# EAGLE design Parameter-Board-8 (EAGLE 6.0)
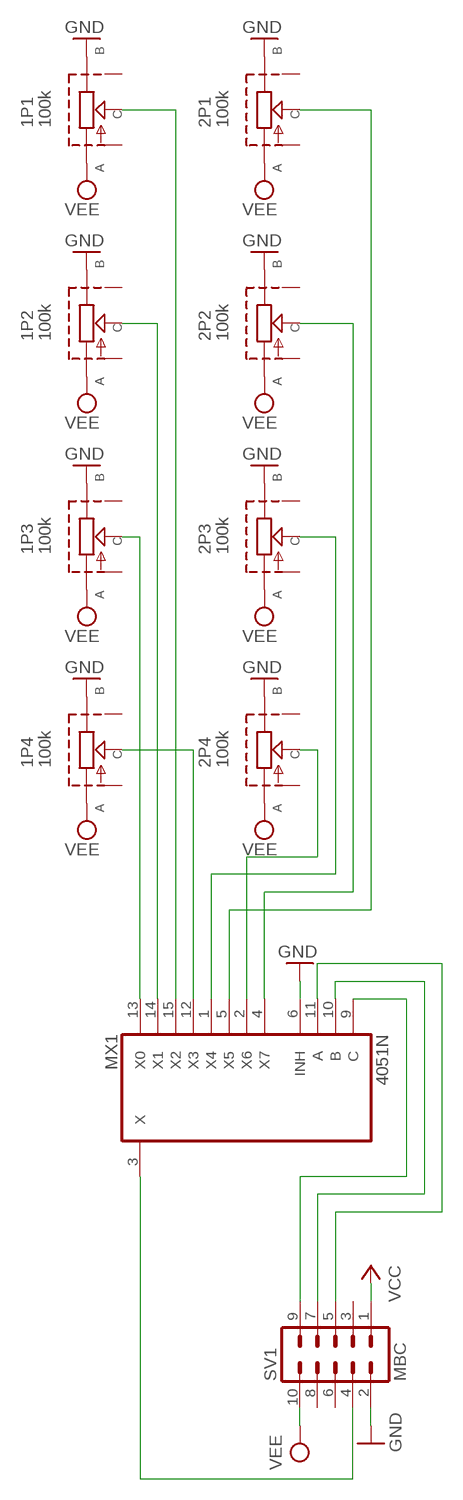
[diagram p0: schematic, sheet 1]

## Parts
1P1  100k  RK09K113  [RK09K113]
1P2  100k  RK09K113  [RK09K113]
1P3  100k  RK09K113  [RK09K113]
1P4  100k  RK09K113  [RK09K113]
2P1  100k  RK09K113  [RK09K113]
2P2  100k  RK09K113  [RK09K113]
2P3  100k  RK09K113  [RK09K113]
2P4  100k  RK09K113  [RK09K113]
MX1  4051N  [DIL16]
SV1  MBC  ML10  [ML10]

## Nets
1P1: 1P1.C MX1.15(X2)
1P2: 1P2.C MX1.14(X1)
1P3: 1P3.C MX1.13(X0)
1P4: 1P4.C MX1.12(X3)
2P1: 2P1.C MX1.5(X5)
2P2: 2P2.C MX1.4(X7)
2P3: 2P3.C MX1.1(X4)
2P4: 2P4.C MX1.2(X6)
A: MX1.11(A) SV1.5
B: MX1.10(B) SV1.7
C: MX1.9(C) SV1.9
GND [supply]: 1P1.B 1P2.B 1P3.B 1P4.B 2P1.B 2P2.B 2P3.B 2P4.B MX1.6(INH) SV1.2
VCC [supply]: SV1.1
VEE: 1P1.A 1P2.A 1P3.A 1P4.A 2P1.A 2P2.A 2P3.A 2P4.A SV1.10
Z: MX1.3(X) SV1.4
Unconnected: 1P1.CASE1 1P1.CASE2 1P2.CASE1 1P2.CASE2 1P3.CASE1 1P3.CASE2 1P4.CASE1 1P4.CASE2 2P1.CASE1 2P1.CASE2 2P2.CASE1 2P2.CASE2 2P3.CASE1 2P3.CASE2 2P4.CASE1 2P4.CASE2 SV1.3 SV1.6 SV1.8

## Power pins joined to a net without a drawn wire
GND: MX1.8(GND)
VCC: MX1.16(VCC)
VEE: MX1.7(VEE)

## Library data of the parts
1P1-1P4 2P1-2P4 = alps:RK09K: Insulated Shaft Potentiometer ALPS Electric Co 9mm Size Snap-in Insulated Shaft Type RK09K -111: horizontal Package -113: vertical Package Reichelt Part No. RK09K111-/RK09K113- LIN10K, 50K, 100K LOG10K, 50K, 100K
MX1 = 40xx:4051: 8-channel ANALOG MULTIPLEXER
SV1 = con-harting-ml:ML10: HARTING; OC_FARNELL: unknown; OC_NEWARK: unknown

## Net classes
0 default: width 0.254 mm
1 supply: width 0.406 mm

## Board
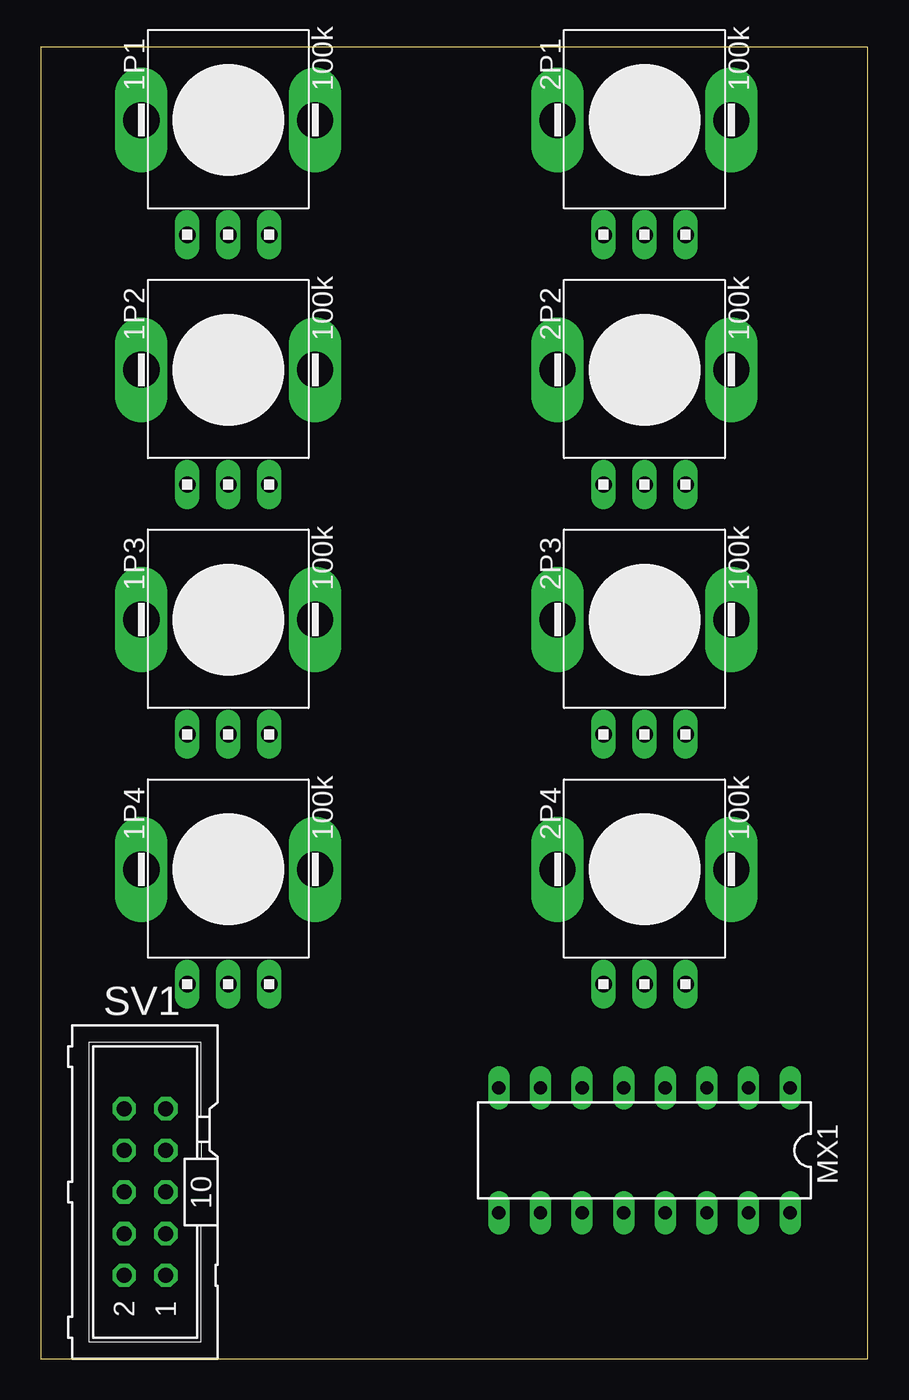
[diagram p1: board, top side]
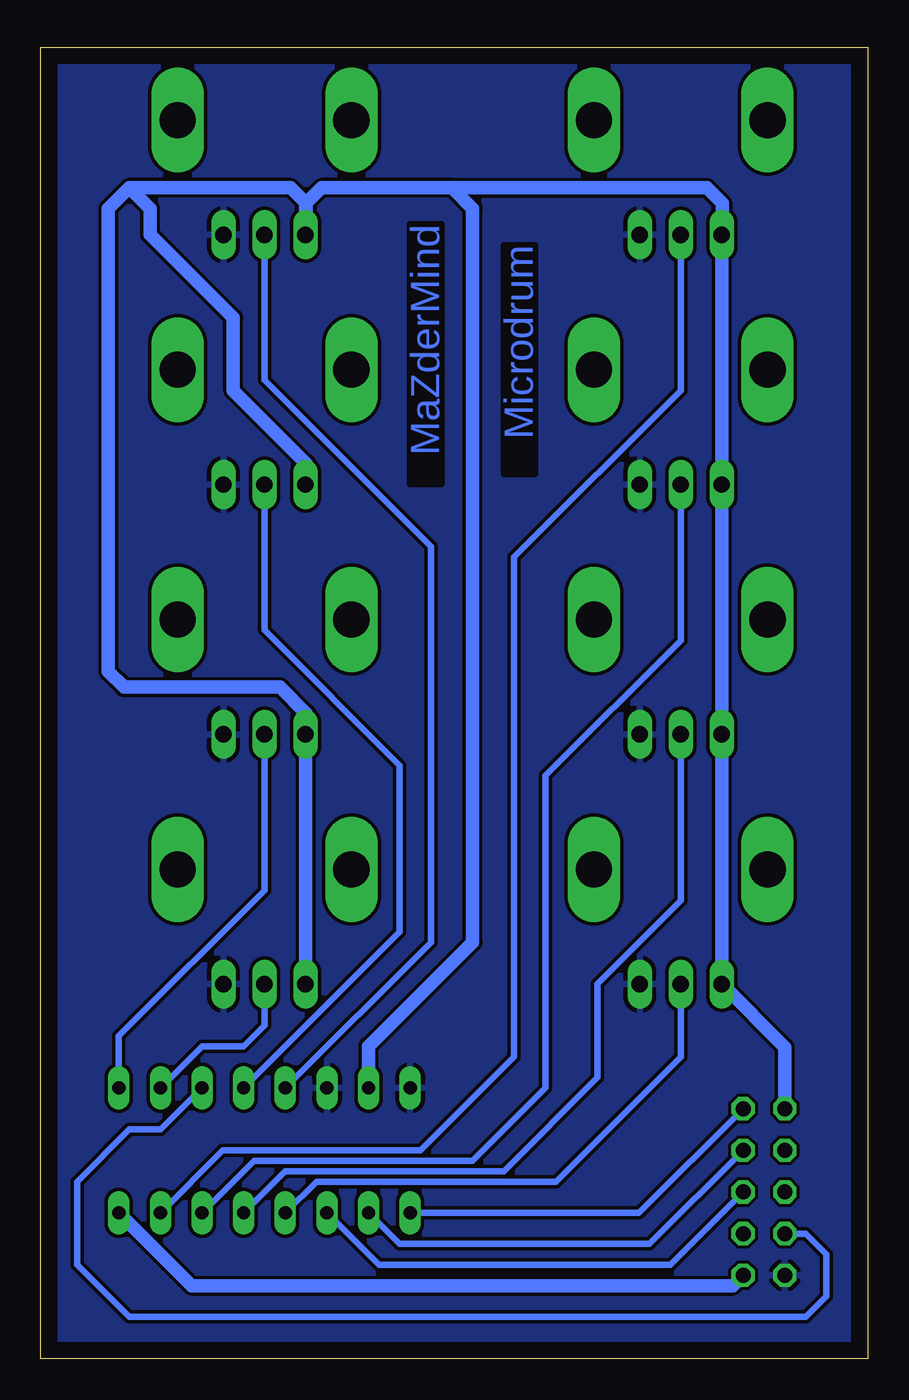
[diagram p2: board, bottom side, seen from below]

Size 50.47 x 80 mm. Coordinates in mm from the lower left corner, seen from the top.
Outline: 0,0 50.47,0 50.47,80 0,80 0,0
Copper layers (1*16): Top 0.035mm / dielectric 1.5mm / Bottom 0.035mm
Design rules: minimum track width 10mil, minimum drill 24mil, track to track 8mil, track to pad 8mil, pad to pad 8mil, via to via 8mil, smd to smd 8mil, copper to edge 40mil, drill to drill 8mil, minimum pad ring 10mil, minimum via ring 8mil, stop-mask expansion 4mil, vias tented up to drill 0mil, thermal gap 10mil
bRestrict: area 20.3,54 to 22.2,67.9; area 26,53.3 to 27.9,69.2

### Footprints (pad centres in the part's own frame; a part is rotated, then mirrored left to right if it is on the bottom)
RK09K113 = drill 1 long: A -2.5,-7; B 2.5,-7; C 0,-7 | drill 2.2 long: CASE1 -5.3,0; CASE2 5.3,0
DIL16 = drill 0.813 long: 1 -8.89,-3.81; 2 -6.35,-3.81; 3 -3.81,-3.81; 4 -1.27,-3.81; 5 1.27,-3.81; 6 3.81,-3.81; 7 6.35,-3.81; 8 8.89,-3.81; 9 8.89,3.81; 10 6.35,3.81; 11 3.81,3.81; 12 1.27,3.81; 13 -1.27,3.81; 14 -3.81,3.81; 15 -6.35,3.81; 16 -8.89,3.81
ML10 = drill 0.914 octagon: 1 -5.08,-1.27; 2 -5.08,1.27; 3 -2.54,-1.27; 4 -2.54,1.27; 5 0,-1.27; 6 0,1.27; 7 2.54,-1.27; 8 2.54,1.27; 9 5.08,-1.27; 10 5.08,1.27

### Placement (x,y rotation side)
1P1  11.43,75.56 0 top
1P2  11.43,60.33 0 top
1P3  11.43,45.09 0 top
1P4  11.43,29.84 0 top
2P1  36.83,75.56 0 top
2P2  36.83,60.33 0 top
2P3  36.83,45.09 0 top
2P4  36.83,29.84 0 top
MX1  36.83,12.7 180 top
SV1  6.35,10.16 90 top

### Tracks (layer width: path | path; a pad name or v marks a point on that pad's centre or on a via)
1P1
  Bottom 0.406: MX1.15 39.37,12.7 27.3,12.7 21.59,18.41 21.59,48.9 11.43,59.05 1P1.C
1P2
  Bottom 0.406: 1P2.C 11.43,43.81 19.68,35.56 19.68,16.51 24.13,12.06 37.47,12.06 MX1.14
1P3
  Bottom 0.406: 1P3.C 11.43,27.94 16.51,22.86 16.51,17.14 22.23,11.43 35.56,11.43 MX1.13
1P4
  Bottom 0.406: 1P4.C 11.43,18.41 19.05,10.79 33.66,10.79 MX1.12
2P1
  Bottom 0.406: MX1.5 26.67,25.4 26.67,49.53 36.83,59.69 2P1.C
2P2
  Bottom 0.406: MX1.4 28.57,26.04 28.57,36.2 36.83,44.45 2P2.C
2P3
  Bottom 0.406: MX1.1 45.72,19.68 36.83,28.57 2P3.C
2P4
  Bottom 0.406: 2P4.C 36.83,20.32 38.1,19.05 40.64,19.05 MX1.2
A
  Bottom 0.406: MX1.11 29.84,5.71 12.06,5.71 SV1.5
B
  Bottom 0.406: MX1.10 28.57,6.99 13.34,6.99 SV1.7
C
  Bottom 0.406: MX1.9 13.97,8.89 SV1.9
GND
  pour Bottom: 0,80.01 50.8,80.01 50.8,0 0,0
VCC
  Bottom 0.813: SV1.1 8.26,4.45 41.27,4.45 MX1.16
VEE
  Bottom 0.813: SV1.10 5.08,19 1P4.A 1P3.A 1P2.A 1P1.A 8.89,68.61 8.89,70.48 9.84,71.44 25.4,71.44 | 45.09,71.44 35.24,71.44 34.33,70.53 2P1.A 34.29,68.61 34.29,70.48 33.34,71.44 25.4,71.44 | 45.09,71.44 46.35,70.17 46.35,41.91 45.4,40.96 35.88,40.96 34.29,39.37 34.29,38.12 2P3.A 2P4.A | MX1.7 30.48,19.05 24.13,25.4 24.13,70.17 25.4,71.44 | 45.09,71.44 43.81,70.17 43.81,68.58 38.73,63.5 38.73,59.05 34.29,54.61 34.33,54.57 2P2.A
Z
  Bottom 0.406: MX1.3 43.18,13.97 45.09,13.97 48.26,10.79 48.26,5.71 45.09,2.54 3.81,2.54 2.54,3.81 2.54,6.35 3.81,7.62 SV1.4

### Text on the board
Bottom: MaZderMind | Microdrum